# EasyEDA Pro project 0.96in TFT彩屏板.epro

# Schematic Schematic1
Create Date: 2022-12-12; Page Name: P1; Project Name: 0.96in TFT彩屏板; Schematic Name: Schematic1; Update Date: 2022-12-12; Company: 嘉立创EDA; Page Size: A4; Version: V1.0
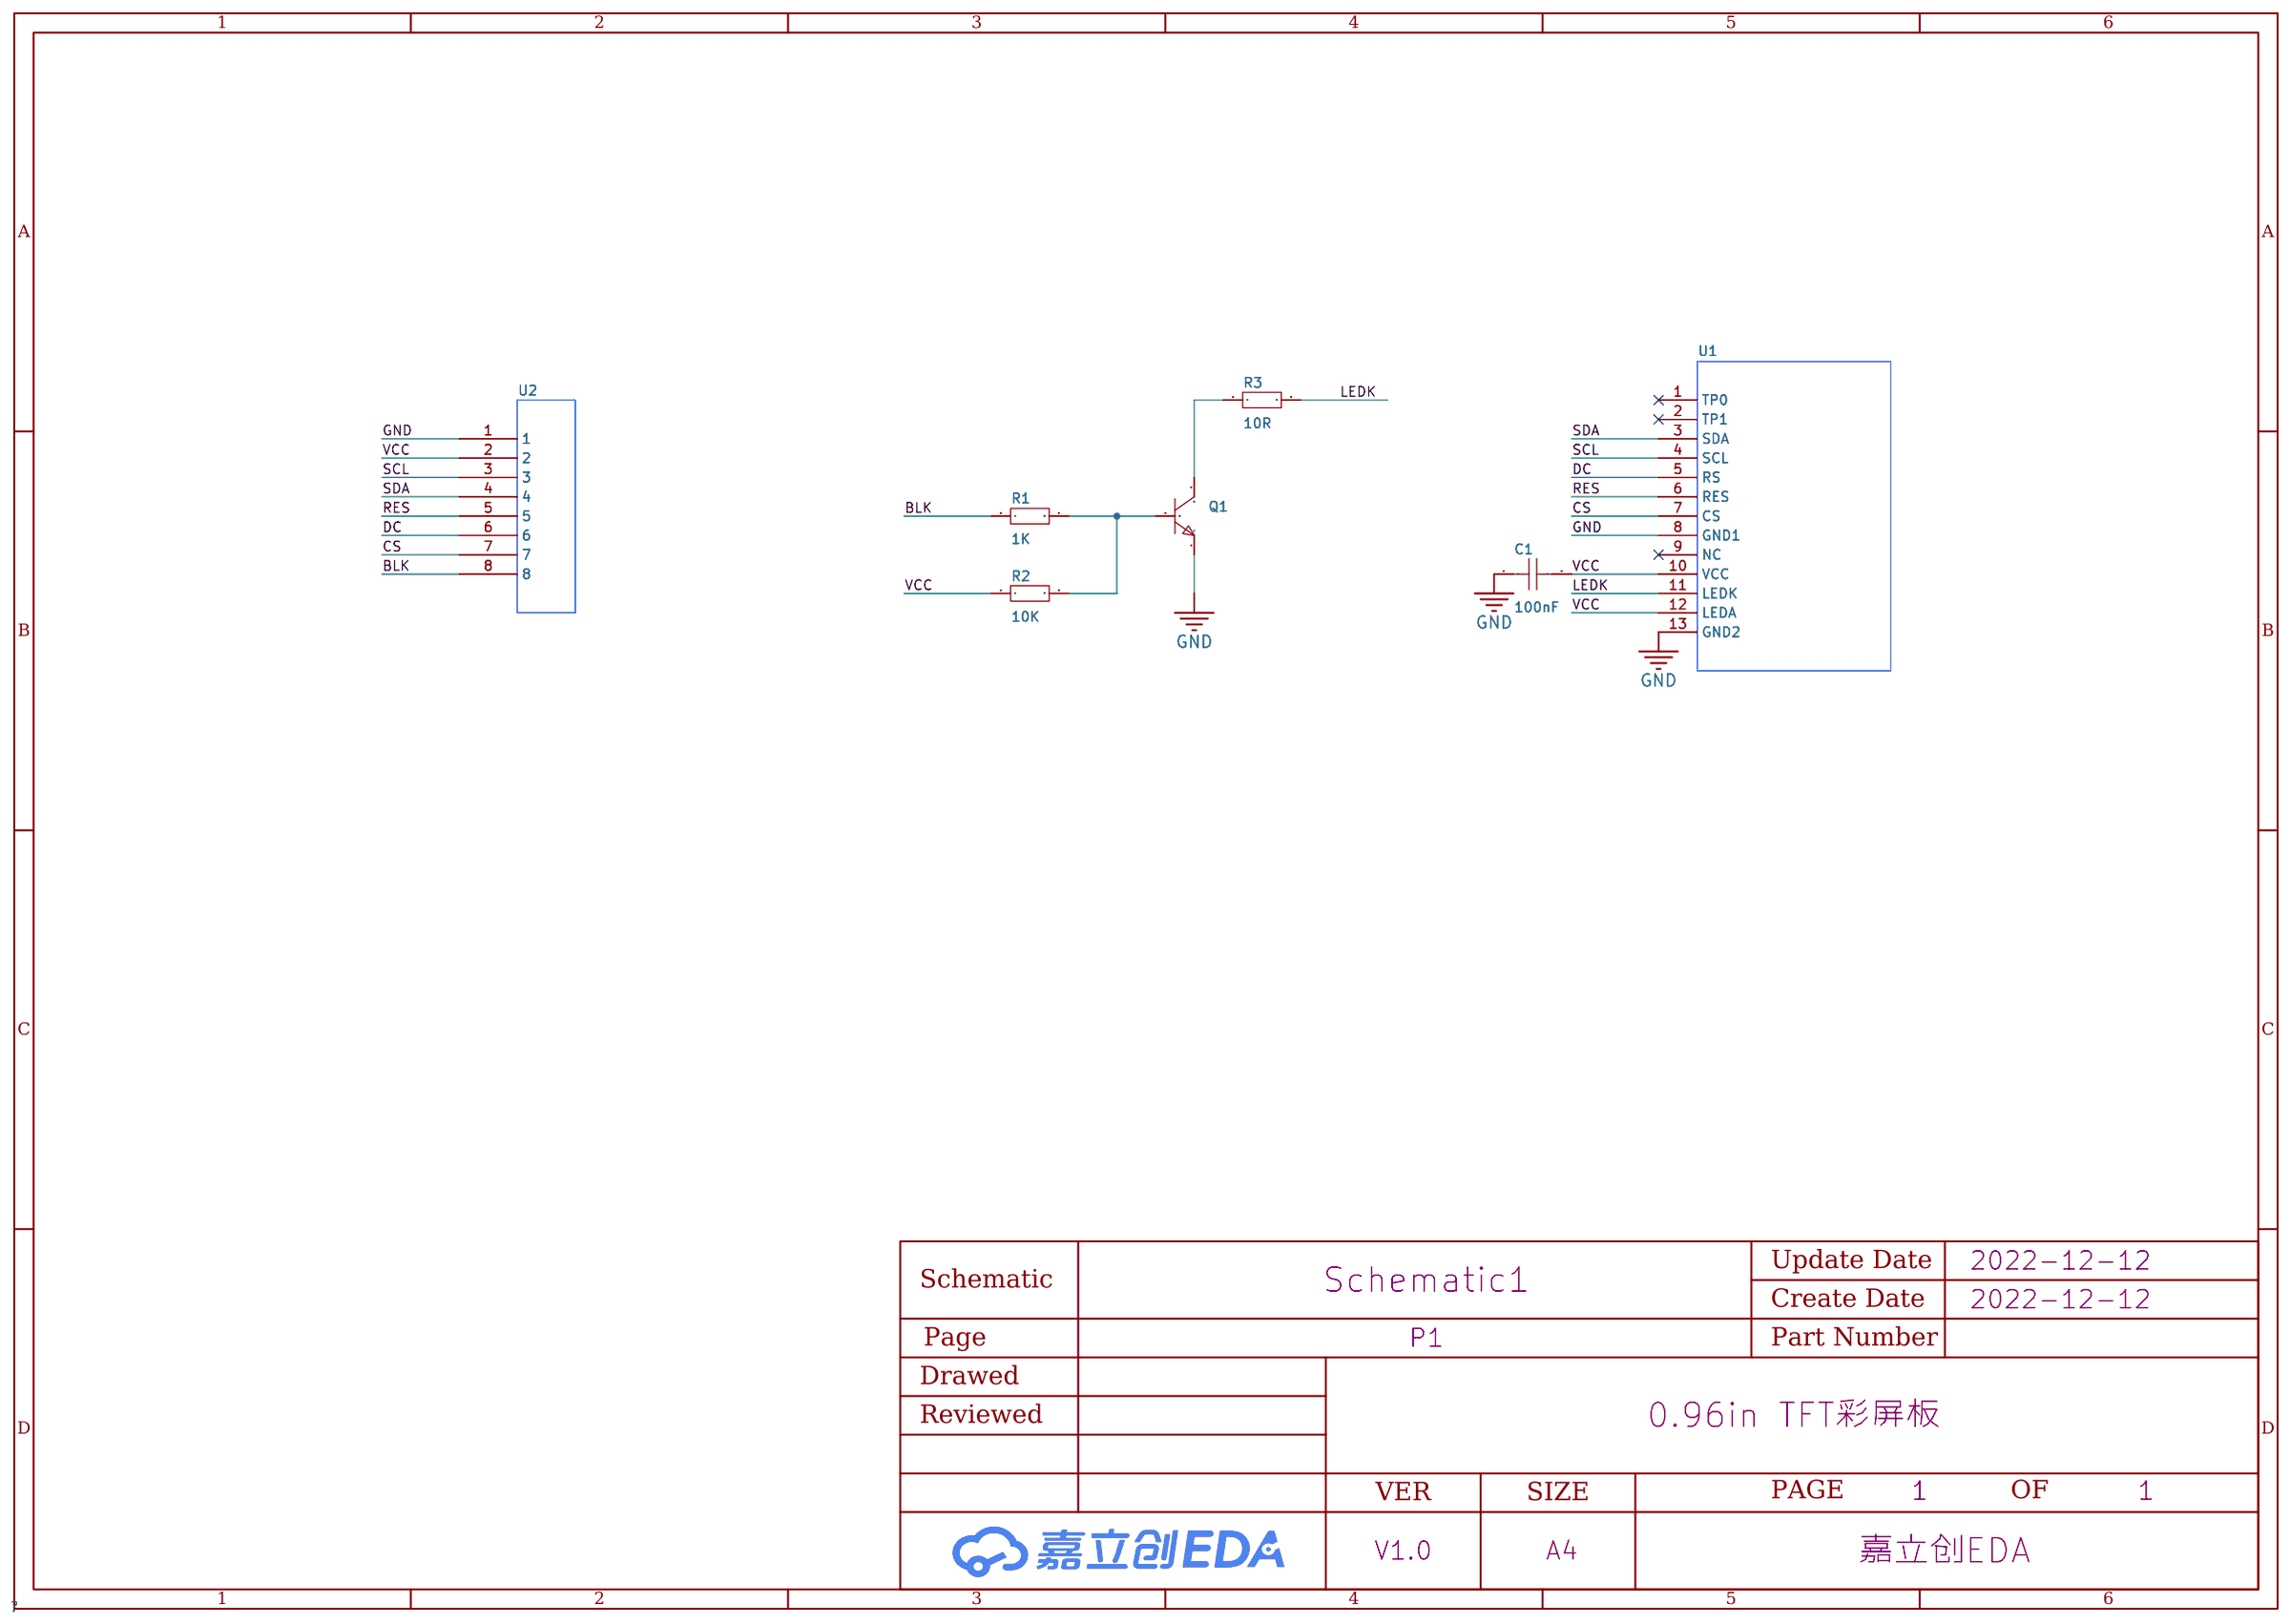
[diagram p0: schematic sheet]

## Parts
C1  100nF  [C0603]
Q1  -  [SOT-23_L2.9-W1.3-P1.90-LS2.4-BR]
R1  1K  [R0603]
R2  10K  [R0603]
R3  10R  [R0603]
U1  -  [LCD 0.96 13Pin]
U2  -  [Header-8P-2.54]

## Library data of the parts
C1 = CAP_0603: Supplier Footprint: 0603
Q1 = S8050_NPN: 晶体管类型:NPN;集射极击穿电压(Vceo):25V;集电极电流(Ic):500mA;功率(Pd):300mW;集电极-发射极饱和电压(VCE(sat)@Ic,Ib):600mV@500mA,50mA;直流电流增益(hFE@Ic,Vce):-;特征频率(fT):150MHz;工作温度:+150℃@(Tj);; Supplier Part: C444723; Supplier Footprint: SOT-23
R1-R3 = Res_0603: Supplier Footprint: 0603
U1 = LCD 0.96 13Pin
U2 = Header-8P-2.54

## Nets
GND: C1.1 Q1.2 U1.8(GND1) U1.13(GND2) U2.1
VCC: C1.2 R2.1 U1.10(VCC) U1.12(LEDA) U2.2
BLK: R1.1 U2.8
CS: U1.7(CS) U2.7
DC: U1.5(RS) U2.6
LEDK: R3.2 U1.11(LEDK)
RES: U1.6(RES) U2.5
SCL: U1.4(SCL) U2.3
SDA: U1.3(SDA) U2.4
$1N638: Q1.1 R1.2 R2.2
$1N758: Q1.3 R3.1

Not connected (* = marked no-connect by the designer): U1 1(TP0)* 2(TP1)* 9(NC)*

# Board PCB1
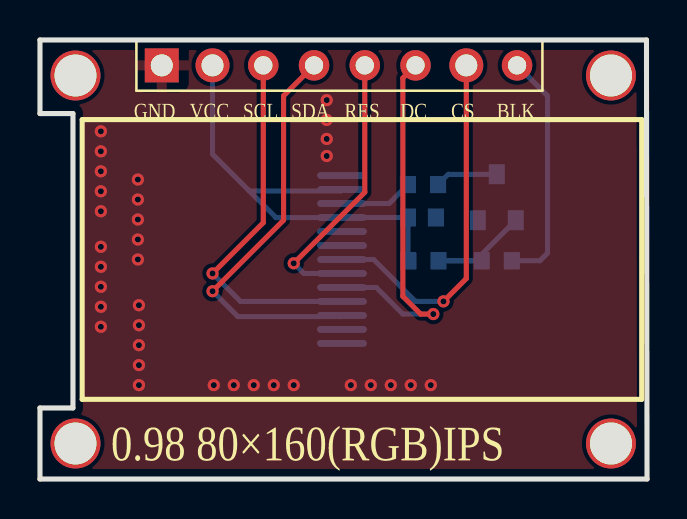
[diagram p1: board, top side]
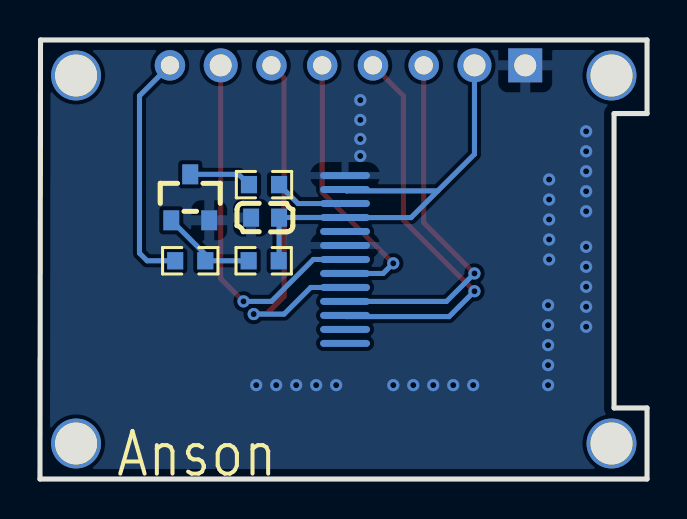
[diagram p2: board, bottom side, seen from below]

Outline 30.38 x 21.97 mm; copper layers: Top Layer, Bottom Layer. Coordinates in mm from the lower left corner of the outline.
Outline path: 0,18.29 0,21.97 30.35,21.97 30.38,0 0,0 0,3.56 1.65,3.56 1.65,18.29 0,18.29
Stack: Top Layer 0.035mm / Dielectric1 1.51mm FR4 er 4.5 / Bottom Layer 0.035mm

## Design rules (mm)
spacing safeClearance (default): track to track 0.152, other pairs 0.152 to 0.3
track width trackWidth (default): min 0.127, default 0.254, max 2.54
differential pair differentialPair (default): width min 0.127, default 0.254, max 2.54; gap min 0.152, default 0.152
via viaSize (default): diameter min 0.5, default 0.61, max 10; hole min 0.3, default 0.305, max 6
net GND uses copperRegion1

## Placement (name value [footprint] x y rotation side)
C1  100nF  [C0603]  19.12 13.08 180 bottom
NOREF  -  [Pad_e195]  1.78 1.78 0 top
NOREF#2  -  [Pad_e188]  28.57 20.19 0 top
NOREF#3  -  [Pad_e186]  1.78 20.19 0 top
NOREF#4  -  [Pad_e194]  28.57 1.78 0 top
Q1  -  [SOT-23_L2.9-W1.3-P1.90-LS2.4-BR]  22.86 14.1 270 bottom
R1  1K  [R0603]  22.86 10.92 180 bottom
R2  10K  [R0603]  19.19 10.92 0 bottom
R3  10R  [R0603]  19.17 14.73 180 bottom
U1  -  [LCD 0.96 13Pin]  15.11 -16.51 0 top
U2  -  [Header-8P-2.54]  4.83 19.43 0 top

## Footprints (pads in the part's own frame, mm; a bottom-side part is the same pattern mirrored in y, then rotated)
C0603
  rect 0.8x0.9 smd: 1(-0.7,0) 2(0.7,0)
Header-8P-2.54
  rect 1.7x1.7 hole 1.1: 1(1.27,1.27)
  round 1.7 hole 1.1: 2(3.81,1.27) 7(16.51,1.27)
  round 1.524 hole 0.914: 3(6.35,1.27) 4(8.89,1.27) 5(11.43,1.27) 6(13.97,1.27) 8(19.05,1.27)
LCD 0.96 13Pin
  rrect 2.5x0.35 smd far side: 1(0,23.297) 2(0,23.997) 3(0,24.697) 4(0,25.397) 5(0,26.097) 6(0,26.797) 7(0,27.497) 8(0,28.197) 9(0,28.897) 10(0,29.597) 11(0,30.297) 12(0,30.997) 13(0,31.697)
Pad_e186
  round 2.5 hole 2.1: 1(0,0)
Pad_e188
  round 2.5 hole 2.1: 1(0,0)
Pad_e194
  round 2.5 hole 2.1: 1(0,0)
Pad_e195
  round 2.5 hole 2.1: 1(0,0)
R0603
  rect 0.806x0.864 smd: 1(-0.753,0) 2(0.753,0)
SOT-23_L2.9-W1.3-P1.90-LS2.4-BR
  rect 1x0.8 smd: 1(1.15,-0.95) 2(1.15,0.95) 3(-1.15,0)

## Nets
As in the schematic.

Pads without a net: NOREF 1; NOREF#2 1; NOREF#3 1; NOREF#4 1; U1 1 2 9

## Via types
v1: diameter 0.61, hole 0.305, Top Layer to Bottom Layer, 39 vias

## Routing (per net, layer and track width the routed paths; a pad name or vN(x,y) marks a point on that pad's centre or on a via; arc(x,y) is an arc through that point)
GND:
  vias: v1(3.05,17.4) v1(3.05,16.4) v1(3.05,15.4) v1(3.05,14.4) v1(3.05,13.4) v1(3.05,11.62) v1(3.05,10.62) v1(3.05,9.62) v1(3.05,8.62) v1(3.05,7.62) v1(4.9,14.99) v1(4.9,13.99) v1(4.9,12.99) v1(4.9,11.99) v1(4.9,10.99) v1(4.95,8.7) v1(4.95,7.7) v1(4.95,6.7) v1(4.95,5.7) v1(4.95,4.7) v1(8.7,4.7) v1(9.7,4.7) v1(10.7,4.7) v1(11.7,4.7) v1(12.7,4.7) v1(14.35,18.96) v1(14.35,17.97) v1(14.35,17.02) v1(14.35,16.17) v1(15.56,4.7) v1(16.56,4.7) v1(17.56,4.7) v1(18.56,4.7) v1(19.56,4.7)
VCC: length 22.7
  Bottom Layer w0.254: 10.47,14.42 11.81,13.08 15.46,13.08 15.46,13.09 ; 10.47,14.42 15.04,14.42 U1.12 ; 10.47,14.42 8.64,16.26 U2.2 ; U1.10 15.46,13.09 ; 15.46,13.09 18.41,13.09 C1.2 18.41,10.94 R2.1
BLK: length 12
  Bottom Layer w0.254: R1.1 25.02,10.92 25.4,11.3 25.4,19.18 U2.8
CS: length 18.2
  Top Layer w0.254: U2.7 21.34,10.03 v1(20.19,8.89)
  Bottom Layer w0.254: v1(20.19,8.89) 18.8,8.89 16.7,10.99 U1.7
DC: length 18.8
  Top Layer w0.254: v1(19.69,8.25) 19.05,8.25 18.16,9.14 18.16,20.07 U2.6
  Bottom Layer w0.254: U1.5 16.83,9.59 18.16,8.25 v1(19.69,8.25)
LEDK: length 3.7
  Bottom Layer w0.254: U1.11 17.47,13.79 R3.2
RES: length 14
  Top Layer w0.254: U2.5 16.26,14.35 v1(12.7,10.8)
  Bottom Layer w0.254: U1.6 13.21,10.29 v1(12.7,10.8)
SCL: length 18.5
  Top Layer w0.254: v1(8.64,10.29) 11.18,12.83 U2.3
  Bottom Layer w0.254: v1(8.64,10.29) 10.04,8.89 U1.4
SDA: length 20.4
  Top Layer w0.254: U2.4 12.19,19.18 12.19,12.95 v1(8.64,9.4)
  Bottom Layer w0.254: U1.3 15.05,8.13 9.91,8.13 v1(8.64,9.4)
$1N638: length 4.9
  Bottom Layer w0.254: 23.81,12.95 22.11,11.24 R1.2 R2.2
$1N758: length 3.2
  Bottom Layer w0.254: Q1.3 20.44,15.25 R3.1

## Copper pours and planes (outline as drawn; the poured copper is in the pictures)
GND on Top Layer: 0,21.97 30.38,21.97 30.38,0 0,0
GND on Bottom Layer: 0,21.97 30.38,21.97 30.38,0 0,0

## Text on the board
Bottom Silkscreen Layer: Anson
Top Silkscreen Layer: GND | VCC | SCL | SDA | RES | DC | CS | BLK | 0.98 80×160(RGB)IPS
